# EAGLE design BugBomb (EAGLE 9.6.2)
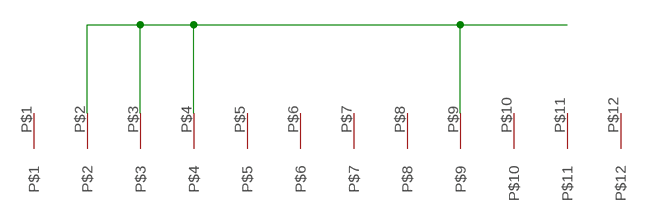
[diagram p0: schematic, sheet 1]

## Parts
U$1  BEAST  [BEAST]

## Nets
N$1: U$1.P$2 U$1.P$3 U$1.P$4 U$1.P$9
Unconnected: U$1.P$1 U$1.P$5 U$1.P$6 U$1.P$7 U$1.P$8 U$1.P$10 U$1.P$11 U$1.P$12

## Library data of the parts
U$1 = beastpins:BEAST

## Board
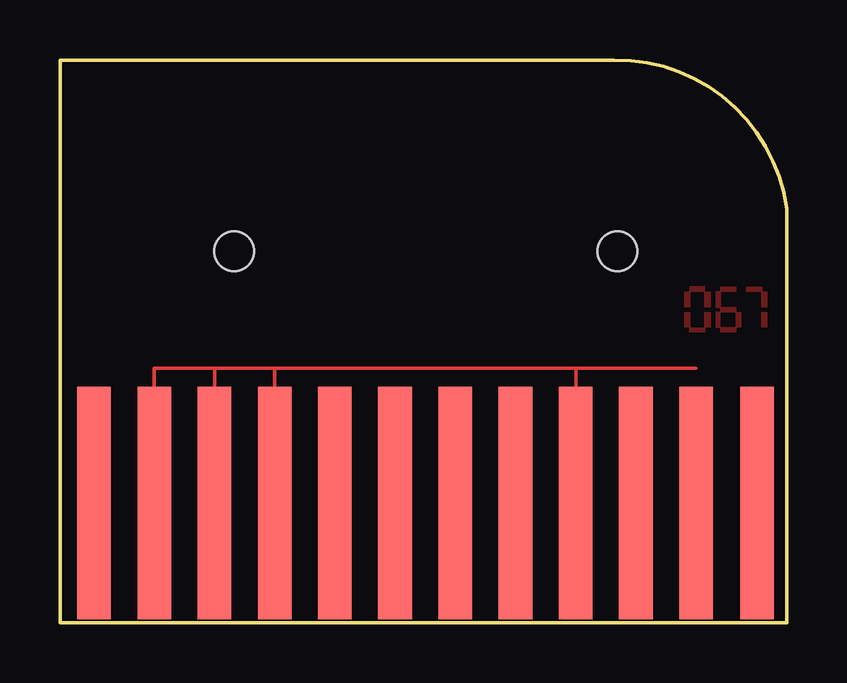
[diagram p1: board, top side]

Size 30.3 x 23.45 mm. Coordinates in mm from the lower left corner, seen from the top.
Outline: 0,0 30.3,0 30.3,17.25 arc83 23.1,23.45 0,23.45 0,0
Copper layers (1*16): Top 0.035mm / dielectric 1.5mm / Bottom 0.035mm
Design rules "default *": minimum track width 6mil, minimum drill 0.35mm, track to track 1mil, track to pad 6mil, pad to pad 6mil, via to via 6mil, smd to smd 6mil, copper to edge 0.002540625mm, drill to drill 1mil, minimum pad ring 10mil, minimum via ring 8mil, stop-mask expansion 4mil, vias tented up to drill 0mil, thermal gap 10mil
Holes 1.65 mm at 7.27,15.49 23.23,15.49

### Footprints (pad centres in the part's own frame; a part is rotated, then mirrored left to right if it is on the bottom)
BEAST = smd 1.4 x 9.7: P$1 -27.61,5.02; P$2 -25.1,5.02; P$3 -22.59,5.02; P$4 -20.08,5.02; P$5 -17.57,5.02; P$6 -15.06,5.02; P$7 -12.55,5.02; P$8 -10.04,5.02; P$9 -7.53,5.02; P$10 -5.02,5.02; P$11 -2.51,5.02; P$12 0.03,5.02

### Placement (x,y rotation side)
U$1  29.03,-0.03 0 top

### Tracks (layer width: path | path; a pad name or v marks a point on that pad's centre or on a via)
N$1
  Top 0.152: 6.47,10.6 3.93,10.6 U$1.P$2 | 6.47,10.6 8.92,10.6 | 8.92,10.6 21.5,10.6 | 21.5,10.6 26.52,10.6 | U$1.P$4 8.95,10.57 8.92,10.6 | U$1.P$3 6.44,10.57 6.47,10.6 | U$1.P$9 21.5,10.6
N$2
  pour Top: 27.11,13.16 26.9,13.16 26.9,13.79 27.11,13.79
N$3
  pour Top: 26.27,14 26.27,13.8 26.9,13.8 26.9,14
N$4
  pour Top: 26.27,12.32 26.06,12.32 26.06,12.95 26.27,12.95
N$5
  pour Top: 27.11,12.32 26.9,12.32 26.9,12.95 27.11,12.95
N$6
  pour Top: 28.19,12.95 27.56,12.95 27.56,13.16 28.19,13.16
N$7
  pour Top: 28.19,13.79 27.56,13.79 27.56,14 28.19,14
N$8
  pour Top: 27.35,12.95 27.35,12.32 27.54,12.32 27.54,12.95
N$9
  pour Top: 28.19,12.11 27.56,12.11 27.56,12.32 28.19,12.32
N$10
  pour Top: 28.4,12.32 28.2,12.32 28.2,12.95 28.4,12.95
N$11
  pour Top: 29.25,13.79 28.63,13.79 28.63,14 29.25,14
N$12
  pour Top: 26.9,12.11 26.27,12.11 26.27,12.3 26.9,12.3
N$19
  pour Top: 26.27,13.16 26.06,13.16 26.06,13.79 26.27,13.79
N$31
  pour Top: 27.35,13.79 27.35,13.16 27.54,13.16 27.54,13.79
N$34
  pour Top: 29.47,12.32 29.26,12.32 29.26,12.95 29.47,12.95
N$38
  pour Top: 29.47,13.16 29.26,13.16 29.26,13.79 29.47,13.79